# EAGLE schematic multiplex-logic-function (EAGLE 7.7.0)
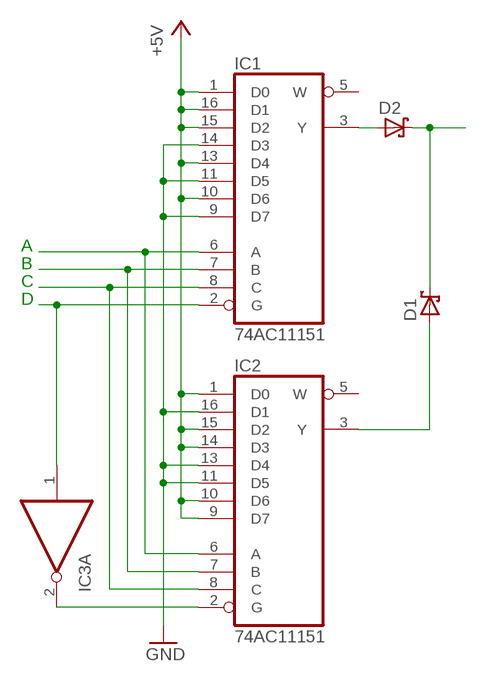
[diagram p0: schematic, sheet 1]

## Parts
D1  BAS70  [SOT23]
D2  BAS70  [SOT23]
IC1  74AC11151  [DIL16]
IC2  74AC11151  [DIL16]
IC3  74AC06N  [DIL14]

## Nets
+5V: IC1.1(D0) IC1.10(D6) IC1.13(D4) IC1.15(D2) IC1.16(D1) IC2.1(D0) IC2.9(D7) IC2.10(D6) IC2.14(D3) IC2.15(D2)
GND: IC1.9(D7) IC1.11(D5) IC1.14(D3) IC2.11(D5) IC2.13(D4) IC2.16(D1)
N$1: D1.1(A) IC2.3(Y)
N$2: D2.1(A) IC1.3(Y)
N$3: D1.3(C) D2.3(C)
N$4: IC1.6(A) IC2.6(A)
N$5: IC1.7(B) IC2.7(B)
N$6: IC1.8(C) IC2.8(C)
N$7: IC1.2(G) IC3.1(A:I)
N$8: IC2.2(G) IC3.2(A:O)
Unconnected: IC1.5(W) IC2.5(W) IC3.3(B:I) IC3.4(B:O) IC3.5(C:I) IC3.6(C:O) IC3.8(D:O) IC3.9(D:I) IC3.10(E:O) IC3.11(E:I) IC3.12(F:O) IC3.13(F:I)

## Notes on the sheet
- A
- B
- C
- D

## Power pins joined to a net without a drawn wire
GND: IC1.4(GND) IC2.4(GND) IC3.7(P:GND)
VCC: IC1.12(VCC) IC2.12(VCC) IC3.14(P:VCC)

## Library data of the parts
D1 D2 = diode:BAS70: Silicon Schottky Diodes General-purpose diode for high-speed switching
IC1 IC2 = 74ac-logic:74AC11151: 1 of 8 DATA SELECTOR/MULTIPLEXER
IC3 = 74xx-eu:74*06: Hex INVERTER, open collector high-voltage output